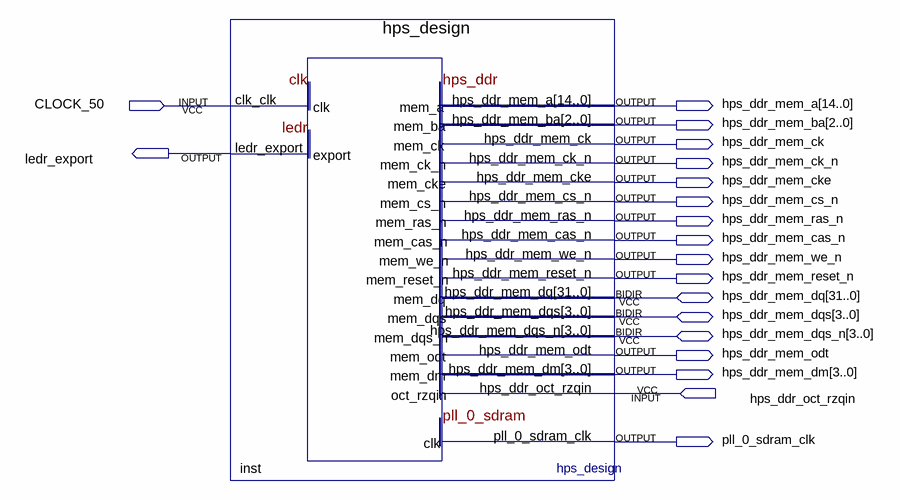
[diagram p0: schematic sheet]
// Quartus schematic chris_HPS.bdf as structural Verilog: 1 symbols, 19 pins
module chris_HPS (
  input  CLOCK_50,
  input  hps_ddr_oct_rzqin,
  inout  [31:0] hps_ddr_mem_dq,
  inout  [3:0] hps_ddr_mem_dqs,
  inout  [3:0] hps_ddr_mem_dqs_n,
  output [14:0] hps_ddr_mem_a,
  output [2:0] hps_ddr_mem_ba,
  output hps_ddr_mem_ck,
  output ledr_export,
  output hps_ddr_mem_ck_n,
  output hps_ddr_mem_cke,
  output hps_ddr_mem_cs_n,
  output hps_ddr_mem_ras_n,
  output hps_ddr_mem_cas_n,
  output hps_ddr_mem_we_n,
  output hps_ddr_mem_reset_n,
  output hps_ddr_mem_odt,
  output [3:0] hps_ddr_mem_dm,
  output pll_0_sdram_clk
);

  hps_design inst (
    .clk_clk(CLOCK_50), .hps_ddr_oct_rzqin(hps_ddr_oct_rzqin), .hps_ddr_mem_a(hps_ddr_mem_a),
    .hps_ddr_mem_ba(hps_ddr_mem_ba), .hps_ddr_mem_ck(hps_ddr_mem_ck), .hps_ddr_mem_ck_n(hps_ddr_mem_ck_n),
    .hps_ddr_mem_cke(hps_ddr_mem_cke), .hps_ddr_mem_cs_n(hps_ddr_mem_cs_n),
    .hps_ddr_mem_ras_n(hps_ddr_mem_ras_n), .hps_ddr_mem_cas_n(hps_ddr_mem_cas_n),
    .hps_ddr_mem_we_n(hps_ddr_mem_we_n), .hps_ddr_mem_reset_n(hps_ddr_mem_reset_n),
    .hps_ddr_mem_odt(hps_ddr_mem_odt), .hps_ddr_mem_dm(hps_ddr_mem_dm), .ledr_export(ledr_export),
    .pll_0_sdram_clk(pll_0_sdram_clk), .hps_ddr_mem_dq(hps_ddr_mem_dq), .hps_ddr_mem_dqs(hps_ddr_mem_dqs),
    .hps_ddr_mem_dqs_n(hps_ddr_mem_dqs_n));
endmodule
